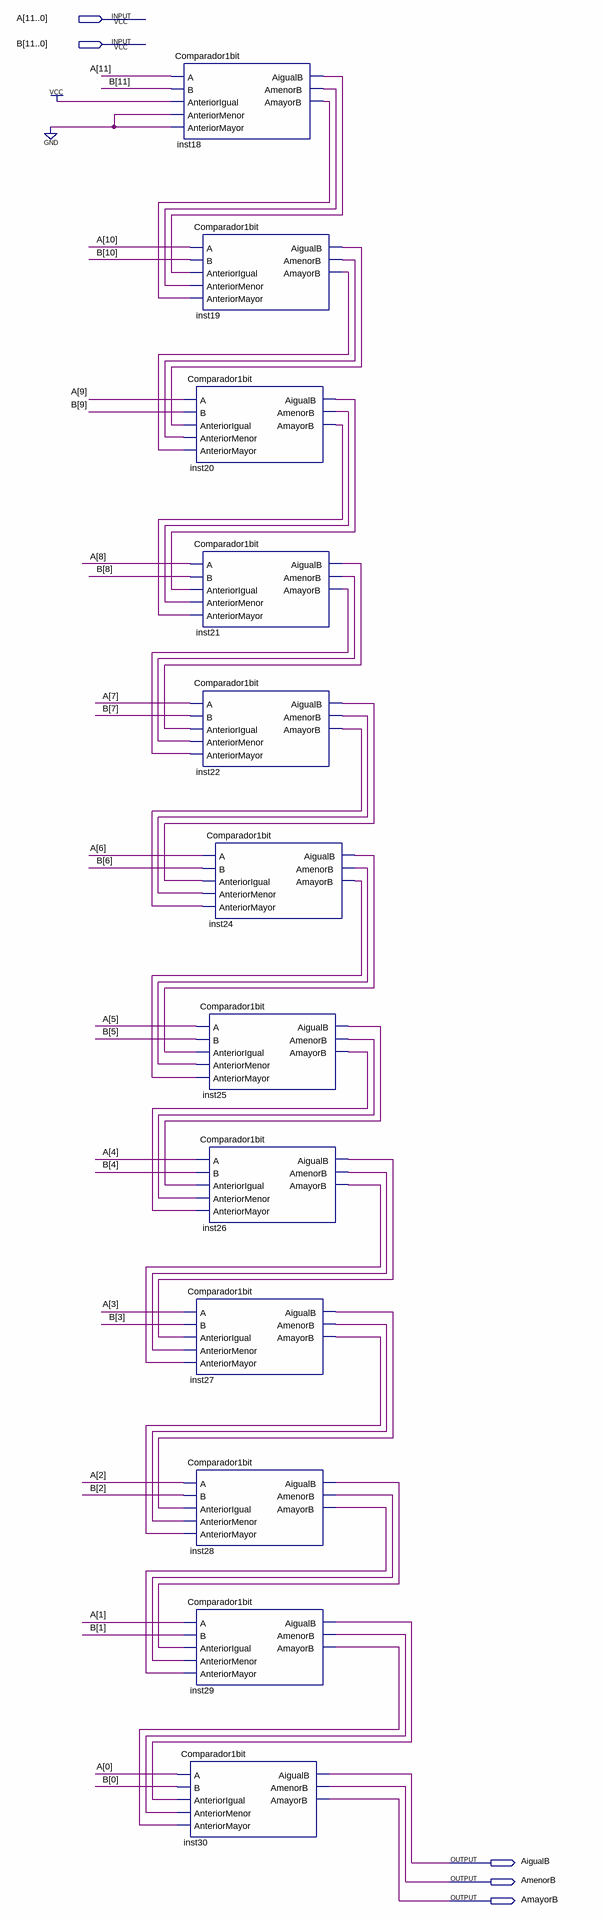
[diagram p0: schematic sheet]
// Quartus schematic Comparador12bits.bdf as structural Verilog: 12 symbols, 5 pins
module Comparador12bits (
  input  [11:0] A,
  input  [11:0] B,
  output AigualB,
  output AmenorB,
  output AmayorB
);

  wire inst18_aigualb, inst18_amayorb, inst18_amenorb, inst19_aigualb, inst19_amayorb, inst19_amenorb,
       inst20_aigualb, inst20_amayorb, inst20_amenorb, inst21_aigualb, inst21_amayorb, inst21_amenorb,
       inst22_aigualb, inst22_amayorb, inst22_amenorb, inst24_aigualb, inst24_amayorb, inst24_amenorb,
       inst25_aigualb, inst25_amayorb, inst25_amenorb, inst26_aigualb, inst26_amayorb, inst26_amenorb,
       inst27_aigualb, inst27_amayorb, inst27_amenorb, inst28_aigualb, inst28_amayorb, inst28_amenorb,
       inst29_aigualb, inst29_amayorb, inst29_amenorb;

  Comparador1bit inst18 (
    .A(A[11]), .B(B[11]), .AnteriorIgual(1'b1), .AnteriorMenor(1'b0), .AnteriorMayor(1'b0),
    .AigualB(inst18_aigualb), .AmenorB(inst18_amenorb), .AmayorB(inst18_amayorb));
  Comparador1bit inst19 (
    .A(A[10]), .B(B[10]), .AnteriorIgual(inst18_aigualb), .AnteriorMenor(inst18_amenorb),
    .AnteriorMayor(inst18_amayorb), .AigualB(inst19_aigualb), .AmenorB(inst19_amenorb),
    .AmayorB(inst19_amayorb));
  Comparador1bit inst20 (
    .A(A[9]), .B(B[9]), .AnteriorIgual(inst19_aigualb), .AnteriorMenor(inst19_amenorb),
    .AnteriorMayor(inst19_amayorb), .AigualB(inst20_aigualb), .AmenorB(inst20_amenorb),
    .AmayorB(inst20_amayorb));
  Comparador1bit inst21 (
    .A(A[8]), .B(B[8]), .AnteriorIgual(inst20_aigualb), .AnteriorMenor(inst20_amenorb),
    .AnteriorMayor(inst20_amayorb), .AigualB(inst21_aigualb), .AmenorB(inst21_amenorb),
    .AmayorB(inst21_amayorb));
  Comparador1bit inst22 (
    .A(A[7]), .B(B[7]), .AnteriorIgual(inst21_aigualb), .AnteriorMenor(inst21_amenorb),
    .AnteriorMayor(inst21_amayorb), .AigualB(inst22_aigualb), .AmenorB(inst22_amenorb),
    .AmayorB(inst22_amayorb));
  Comparador1bit inst24 (
    .A(A[6]), .B(B[6]), .AnteriorIgual(inst22_aigualb), .AnteriorMenor(inst22_amenorb),
    .AnteriorMayor(inst22_amayorb), .AigualB(inst24_aigualb), .AmenorB(inst24_amenorb),
    .AmayorB(inst24_amayorb));
  Comparador1bit inst25 (
    .A(A[5]), .B(B[5]), .AnteriorIgual(inst24_aigualb), .AnteriorMenor(inst24_amenorb),
    .AnteriorMayor(inst24_amayorb), .AigualB(inst25_aigualb), .AmenorB(inst25_amenorb),
    .AmayorB(inst25_amayorb));
  Comparador1bit inst26 (
    .A(A[4]), .B(B[4]), .AnteriorIgual(inst25_aigualb), .AnteriorMenor(inst25_amenorb),
    .AnteriorMayor(inst25_amayorb), .AigualB(inst26_aigualb), .AmenorB(inst26_amenorb),
    .AmayorB(inst26_amayorb));
  Comparador1bit inst27 (
    .A(A[3]), .B(B[3]), .AnteriorIgual(inst26_aigualb), .AnteriorMenor(inst26_amenorb),
    .AnteriorMayor(inst26_amayorb), .AigualB(inst27_aigualb), .AmenorB(inst27_amenorb),
    .AmayorB(inst27_amayorb));
  Comparador1bit inst28 (
    .A(A[2]), .B(B[2]), .AnteriorIgual(inst27_aigualb), .AnteriorMenor(inst27_amenorb),
    .AnteriorMayor(inst27_amayorb), .AigualB(inst28_aigualb), .AmenorB(inst28_amenorb),
    .AmayorB(inst28_amayorb));
  Comparador1bit inst29 (
    .A(A[1]), .B(B[1]), .AnteriorIgual(inst28_aigualb), .AnteriorMenor(inst28_amenorb),
    .AnteriorMayor(inst28_amayorb), .AigualB(inst29_aigualb), .AmenorB(inst29_amenorb),
    .AmayorB(inst29_amayorb));
  Comparador1bit inst30 (
    .A(A[0]), .B(B[0]), .AnteriorIgual(inst29_aigualb), .AnteriorMenor(inst29_amenorb),
    .AnteriorMayor(inst29_amayorb), .AigualB(AigualB), .AmenorB(AmenorB), .AmayorB(AmayorB));
endmodule
